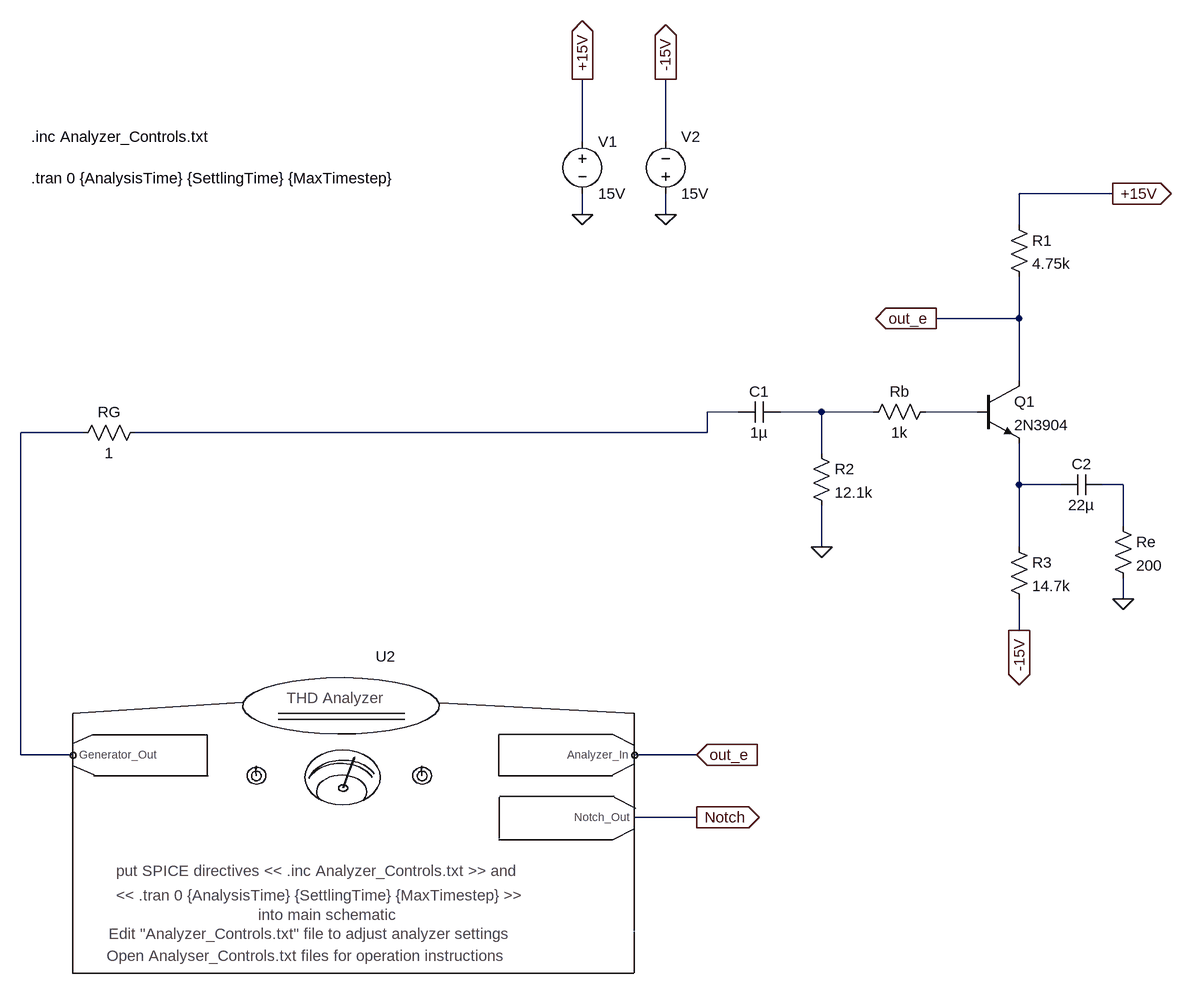
[diagram p0: schematic Example_BJT_THD_TEST.asc]
Example_BJT_THD_TEST.asc, the LTspice schematic file:
Version 4
SHEET 1 5108 4212
WIRE 80 -160 80 -256
WIRE 208 -160 208 -256
WIRE 896 -80 752 -80
WIRE 80 -48 80 -80
WIRE 208 -48 208 -80
WIRE 752 -32 752 -80
WIRE 752 112 752 48
WIRE 752 112 624 112
WIRE 752 208 752 112
WIRE 320 256 272 256
WIRE 448 256 384 256
WIRE 528 256 448 256
WIRE 688 256 608 256
WIRE -688 288 -784 288
WIRE 272 288 272 256
WIRE 272 288 -608 288
WIRE 448 320 448 256
WIRE 752 368 752 304
WIRE 816 368 752 368
WIRE 912 368 880 368
WIRE 912 432 912 368
WIRE 448 464 448 400
WIRE 752 464 752 368
WIRE 912 544 912 512
WIRE 752 592 752 544
WIRE -784 784 -784 288
WIRE -704 784 -784 784
WIRE 256 784 160 784
WIRE 256 880 160 880
FLAG 80 -48 0
FLAG 208 -48 0
FLAG 80 -256 +15V
IOPIN 80 -256 Out
FLAG 208 -256 -15V
IOPIN 208 -256 Out
FLAG 896 -80 +15V
IOPIN 896 -80 Out
FLAG 752 592 -15V
IOPIN 752 592 Out
FLAG 624 112 out_e
IOPIN 624 112 Out
FLAG 912 544 0
FLAG 256 784 out_e
IOPIN 256 784 In
FLAG 448 464 0
FLAG 256 880 Notch
IOPIN 256 880 Out
SYMBOL npn 688 208 R0
SYMATTR InstName Q1
SYMATTR Value 2N3904
SYMBOL res 736 -48 R0
SYMATTR InstName R1
SYMATTR Value 4.75k
SYMBOL voltage 80 -176 R0
WINDOW 123 0 0 Left 0
WINDOW 39 0 0 Left 0
SYMATTR InstName V1
SYMATTR Value 15V
SYMBOL voltage 208 -64 M180
WINDOW 0 24 104 Left 0
WINDOW 3 24 16 Left 0
SYMATTR InstName V2
SYMATTR Value 15V
SYMBOL res 736 448 R0
SYMATTR InstName R3
SYMATTR Value 14.7k
SYMBOL cap 816 384 R270
WINDOW 0 32 32 VTop 0
WINDOW 3 0 32 VBottom 0
SYMATTR InstName C2
SYMATTR Value 22µ
SYMBOL res 896 416 R0
SYMATTR InstName Re
SYMATTR Value 200
SYMBOL cap 320 272 R270
WINDOW 0 32 32 VTop 0
WINDOW 3 0 32 VBottom 0
SYMATTR InstName C1
SYMATTR Value 1µ
SYMBOL res 432 304 R0
SYMATTR InstName R2
SYMATTR Value 12.1k
SYMBOL res 512 272 R270
WINDOW 0 32 56 VTop 0
WINDOW 3 0 56 VBottom 0
SYMATTR InstName Rb
SYMATTR Value 1k
SYMBOL res -704 304 R270
WINDOW 0 32 56 VTop 0
WINDOW 3 0 56 VBottom 0
SYMATTR InstName RG
SYMATTR Value 1
SYMBOL THD_Analyzer -288 752 R0
SYMATTR InstName U2
TEXT -768 -168 Left 0 !.inc Analyzer_Controls.txt
TEXT -768 -104 Left 0 !.tran 0 {AnalysisTime} {SettlingTime} {MaxTimestep}

The netlist it stands for:
* Example_BJT_THD_TEST.asc
Q1 out_e N003 N005 0 2N3904
R1 +15V out_e 4.75k
V1 +15V 0 15V
V2 0 -15V 15V
R3 N005 -15V 14.7k
C2 N005 N006 22µ
Re N006 0 200
C1 N001 N002 1µ
R2 N002 0 12.1k
Rb N002 N003 1k
RG N004 N001 1
XU2 N004 out_e Notch THD_Analyzer  ; pins Generator_Out Analyzer_In Notch_Out
.model NPN NPN
.model PNP PNP
.lib standard.bjt
.inc Analyzer_Controls.txt
.tran 0 {AnalysisTime} {SettlingTime} {MaxTimestep}
.backanno
.end